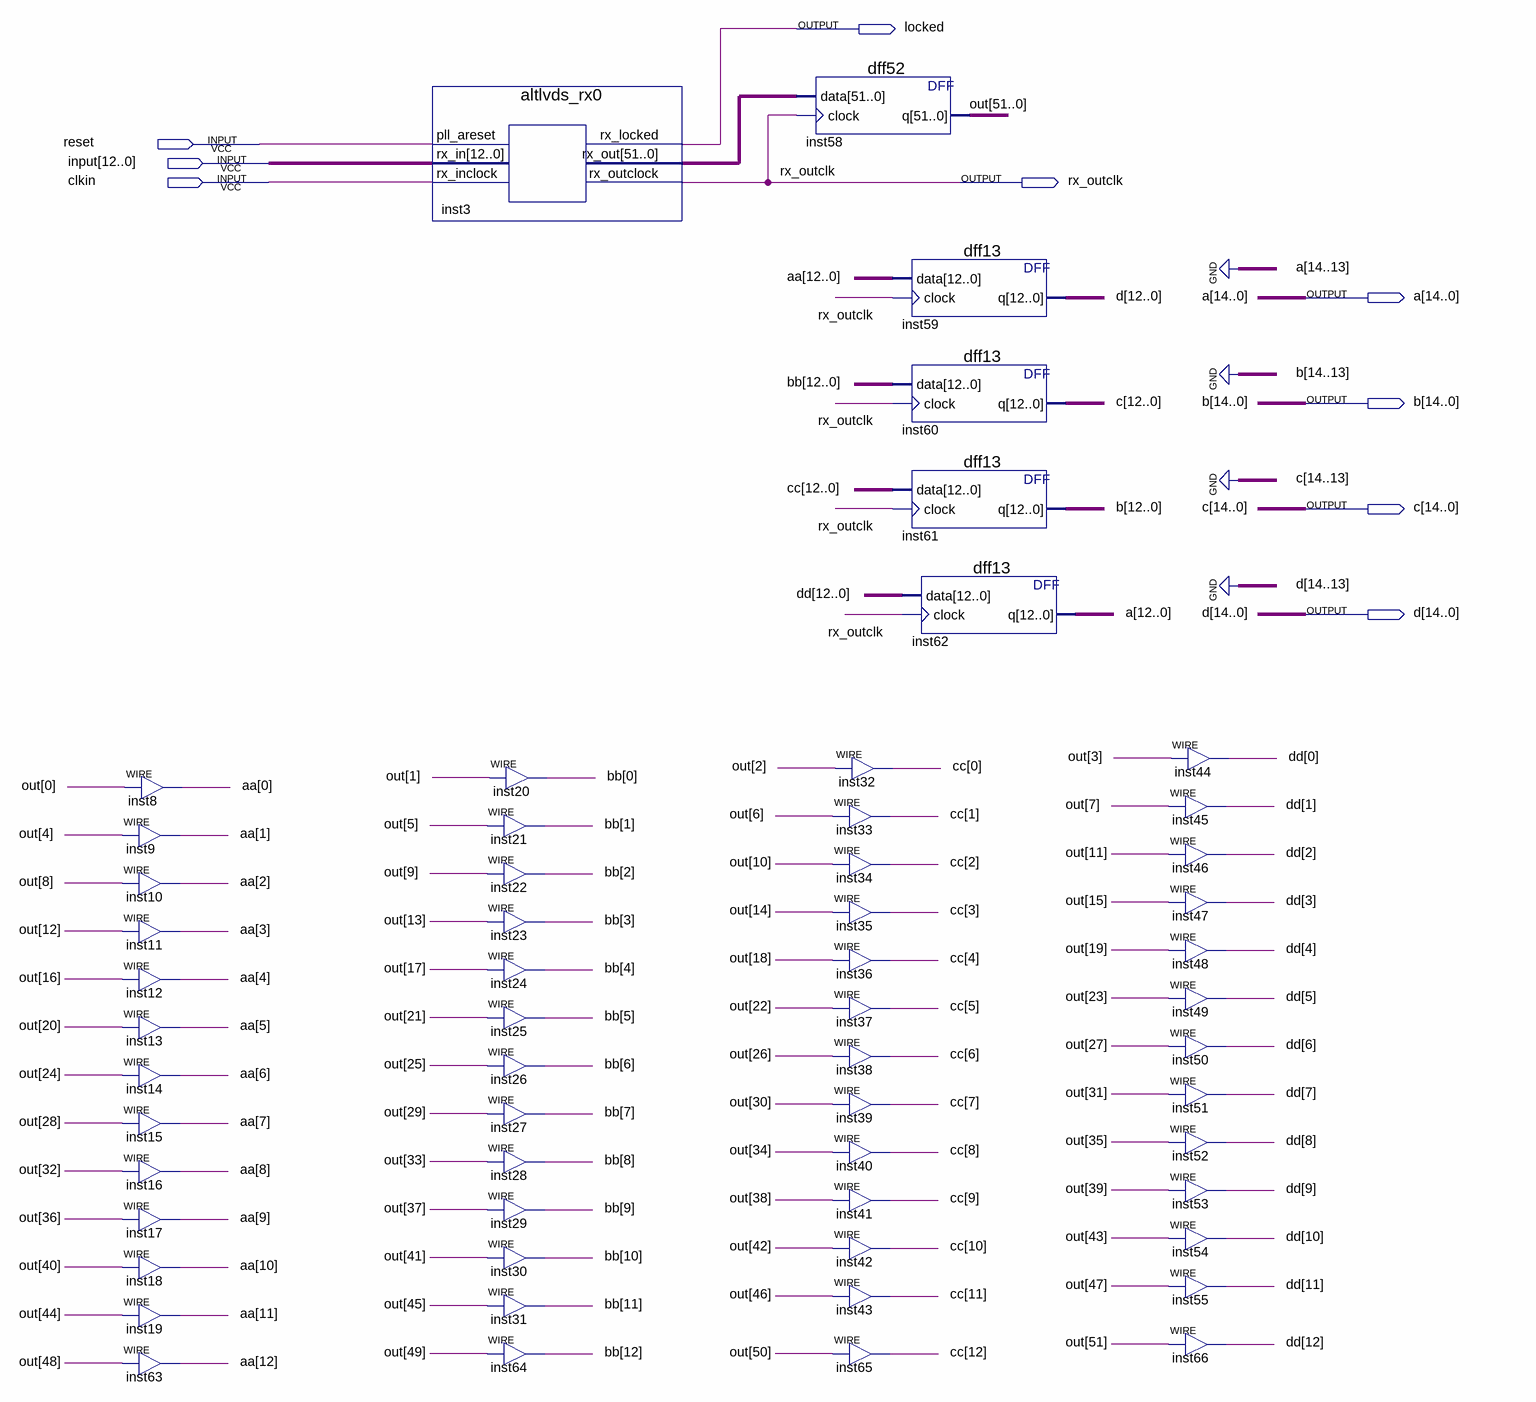
[diagram p0: schematic sheet]
// Quartus schematic 500MHz_Input.bdf as structural Verilog: 58 symbols, 9 pins
module \500MHz_Input  (
  input  reset,
  input  [12:0] \input ,
  input  clkin,
  output locked,
  output rx_outclk,
  output [14:0] a,
  output [14:0] b,
  output [14:0] c,
  output [14:0] d
);

  wire [12:0] aa, bb, cc, dd;
  wire [51:0] inst3_rx_out, out;

  assign aa[0] = out[0];  // WIRE inst8
  assign aa[1] = out[4];  // WIRE inst9
  assign aa[2] = out[8];  // WIRE inst10
  assign aa[3] = out[12];  // WIRE inst11
  assign aa[4] = out[16];  // WIRE inst12
  assign aa[5] = out[20];  // WIRE inst13
  assign aa[6] = out[24];  // WIRE inst14
  assign aa[7] = out[28];  // WIRE inst15
  assign aa[8] = out[32];  // WIRE inst16
  assign aa[9] = out[36];  // WIRE inst17
  assign aa[10] = out[40];  // WIRE inst18
  assign aa[11] = out[44];  // WIRE inst19
  assign aa[12] = out[48];  // WIRE inst63
  altlvds_rx0 inst3 (
    .pll_areset(reset), .rx_in(\input ), .rx_inclock(clkin), .rx_locked(locked), .rx_out(inst3_rx_out),
    .rx_outclock(rx_outclk));
  assign bb[0] = out[1];  // WIRE inst20
  assign bb[1] = out[5];  // WIRE inst21
  assign bb[2] = out[9];  // WIRE inst22
  assign bb[3] = out[13];  // WIRE inst23
  assign bb[4] = out[17];  // WIRE inst24
  assign bb[5] = out[21];  // WIRE inst25
  assign bb[6] = out[25];  // WIRE inst26
  assign bb[7] = out[29];  // WIRE inst27
  assign bb[8] = out[33];  // WIRE inst28
  assign bb[9] = out[37];  // WIRE inst29
  assign bb[10] = out[41];  // WIRE inst30
  assign bb[11] = out[45];  // WIRE inst31
  assign bb[12] = out[49];  // WIRE inst64
  dff52 inst58 (.data(inst3_rx_out), .clock(rx_outclk), .q(out));
  assign cc[1] = out[6];  // WIRE inst33
  assign cc[2] = out[10];  // WIRE inst34
  assign cc[3] = out[14];  // WIRE inst35
  assign cc[4] = out[18];  // WIRE inst36
  assign cc[5] = out[22];  // WIRE inst37
  assign cc[6] = out[26];  // WIRE inst38
  assign cc[7] = out[30];  // WIRE inst39
  assign cc[8] = out[34];  // WIRE inst40
  assign cc[9] = out[38];  // WIRE inst41
  assign cc[10] = out[42];  // WIRE inst42
  assign cc[11] = out[46];  // WIRE inst43
  assign cc[12] = out[50];  // WIRE inst65
  dff13 inst59 (.data(aa), .clock(rx_outclk), .q(d[12:0]));
  dff13 inst60 (.data(bb), .clock(rx_outclk), .q(c[12:0]));
  dff13 inst61 (.data(cc), .clock(rx_outclk), .q(b[12:0]));
  dff13 inst62 (.data(dd), .clock(rx_outclk), .q(a[12:0]));
  assign cc[0] = out[2];  // WIRE inst32
  assign dd[0] = out[3];  // WIRE inst44
  assign dd[1] = out[7];  // WIRE inst45
  assign dd[2] = out[11];  // WIRE inst46
  assign dd[3] = out[15];  // WIRE inst47
  assign dd[4] = out[19];  // WIRE inst48
  assign dd[5] = out[23];  // WIRE inst49
  assign dd[6] = out[27];  // WIRE inst50
  assign dd[7] = out[31];  // WIRE inst51
  assign dd[8] = out[35];  // WIRE inst52
  assign dd[9] = out[39];  // WIRE inst53
  assign dd[10] = out[43];  // WIRE inst54
  assign dd[11] = out[47];  // WIRE inst55
  assign dd[12] = out[51];  // WIRE inst66

  assign a[14:13] = 2'b00;
  assign b[14:13] = 2'b00;
  assign c[14:13] = 2'b00;
  assign d[14:13] = 2'b00;
endmodule
